# Altium schematic sheet batteryDivider.SchDoc
size A4; SheetNumber: 6; SheetTotal: 13
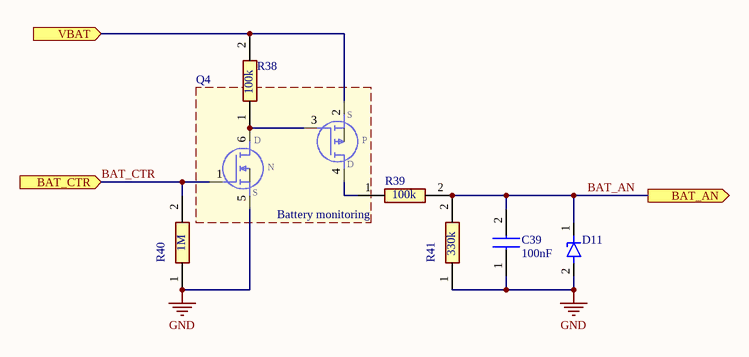
[diagram p0: batteryDivider.SchDoc]

## Parts
C39  100nF  [CAPC1005X70N]
D11  SP3205-01ETG  [SP320501ETG]  (value not drawn)
Q4  SI3552DV-T1-GE3  [SOT95P284X110-6N]  (value not drawn)
R38  100k  [RESC1005X35N]
R39  100k  [RESC1005X40N]
R40  1M  [RESC1005X40N]
R41  330k  [RESC1005X40N]

## Ports
BAT_AN (out, see Power[2D]), BAT_CTR (in, see Power[2D]), VBAT (in, see Power[1D])

## Nets
GND: C39.1 D11.2(A) Q4.5(S1) R40.1 R41.1
BAT_AN: C39.2 D11.1(K) R39.2 R41.2 ; port BAT_AN
BAT_CTR: Q4.1(G1) R40.2 ; port BAT_CTR
VBAT: Q4.2(S2) R38.2 ; port VBAT
NetQ4_3: Q4.3(G2) Q4.6(D1) R38.1
NetQ4_4: Q4.4(D2) R39.1

## Notes on the sheet
- (near R39) Battery monitoring
- Title:
- Date:
- Project:
- Type:
- Schematic
- Variant:
- Revision:
- Sheet
- of
- Author:
- Evžen Šteif
- Size:
- A4
- (in symbol SI3552DV-T1-GE3) S; D; P; N

## Library data of the parts
C39 = GRM155R61A104KA01D: Capacitor; Manufacturer_Name: Murata Electronics; Datasheet Link: https://search.murata.co.jp/Ceramy/image/img/A01X/G101/ENG/GRM155R61A104KA01-02A.pdf; Height: 0.7mm; Manufacturer_Part_Number: GRM155R61A104KA01D; Mouser Part Number: 81-GRM155R61A104KA01; Mouser Price/Stock: https://www.mouser.co.uk/ProductDetail/Murata-Electronics/GRM155R61A104KA01D?qs=5bAuhL3RhmNZw0v59AqOJA%3D%3D; Arrow Part Number: GRM155R61A104KA01D; Arrow Price/Stock: https://www.arrow.com/en/products/grm155r61a104ka01d/murata-manufacturing?utm_currency=USD&region=europe
D11 = SP3205-01ETG: Diode ESD (Uni-directional); Manufacturer_Name: LITTELFUSE; Datasheet Link: https://4donline.ihs.com/images/VipMasterIC/IC/LFSI/LFSI-S-A0010724013/LFSI-S-A0010724013-1.pdf?hkey=6D3A4C79FDBF58556ACFDE234799DDF0; Height: 0.55mm; Manufacturer_Part_Number: SP3205-01ETG; Mouser Part Number: 576-SP3205-01ETG; Mouser Price/Stock: https://www.mouser.co.uk/ProductDetail/Littelfuse/SP3205-01ETG?qs=vHuUswq2%252BswfNhVD4WkB%252BQ%3D%3D; Arrow Part Number: SP3205-01ETG; Arrow Price/Stock: https://www.arrow.com/en/products/sp3205-01etg/littelfuse?utm_currency=USD&region=nac
Q4 = SI3552DV-T1-GE3: Transistor; Manufacturer_Name: Vishay; Datasheet Link: https://componentsearchengine.com/Datasheets/2/SI3552DV-T1-GE3.pdf; Height: 1.1mm; Manufacturer_Part_Number: SI3552DV-T1-GE3; Mouser Part Number: 781-SI3552DV-GE3; Mouser Price/Stock: https://www.mouser.co.uk/ProductDetail/Vishay-Semiconductors/SI3552DV-T1-GE3?qs=kt16UJ73eEF%2FUgkYQb5Vew%3D%3D; Arrow Part Number: SI3552DV-T1-GE3; Arrow Price/Stock: https://www.arrow.com/en/products/si3552dv-t1-ge3/vishay?region=nac
R38 = RT0402FRE07100KL: Resistor; Manufacturer_Name: KEMET; Datasheet Link: https://www.yageo.com/upload/media/product/productsearch/datasheet/rchip/PYu-RT_1-to-0.01_RoHS_L_11.pdf; Height: 0.35mm; Manufacturer_Part_Number: RT0402FRE07100KL; Mouser Part Number: 603-RT0402FRE07100KL; Mouser Price/Stock: https://www.mouser.co.uk/ProductDetail/YAGEO/RT0402FRE07100KL?qs=BXCcY9r%252B08CxTvf5JB1kiw%3D%3D; Arrow Part Number: RT0402FRE07100KL; Arrow Price/Stock: https://www.arrow.com/en/products/rt0402fre07100kl/yageo
R39 = RC0402BR-07100KL: Resistor; Manufacturer_Name: YAGEO; Datasheet Link: https://cz.mouser.com/datasheet/2/447/PYu_RC_Group_51_RoHS_L_12-3368608.pdf; Height: 0.4mm; Manufacturer_Part_Number: RC0402BR-07100KL
R40 = RC0402FR-071ML: Resistor; Manufacturer_Name: YAGEO; Datasheet Link: https://componentsearchengine.com/Datasheets/2/RC0402FR-071ML.pdf; Height: 0.4mm; Manufacturer_Part_Number: RC0402FR-071ML; Mouser Part Number: 603-RC0402FR-071ML; Mouser Price/Stock: https://www.mouser.co.uk/ProductDetail/YAGEO/RC0402FR-071ML?qs=V1yeUXFNrknfoI4987wfBQ%3D%3D; Arrow Part Number: RC0402FR-071ML; Arrow Price/Stock: https://www.arrow.com/en/products/rc0402fr-071ml/yageo?region=nac
R41 = RC0402BR-07330KL: Resistor; Manufacturer_Name: YAGEO; Datasheet Link: https://cz.mouser.com/datasheet/2/447/PYu_RC_Group_51_RoHS_L_11-1984063.pdf; Height: 0.4mm; Manufacturer_Part_Number: RC0402BR-07330KL